# EAGLE design js220_bp (EAGLE 9.6.2)
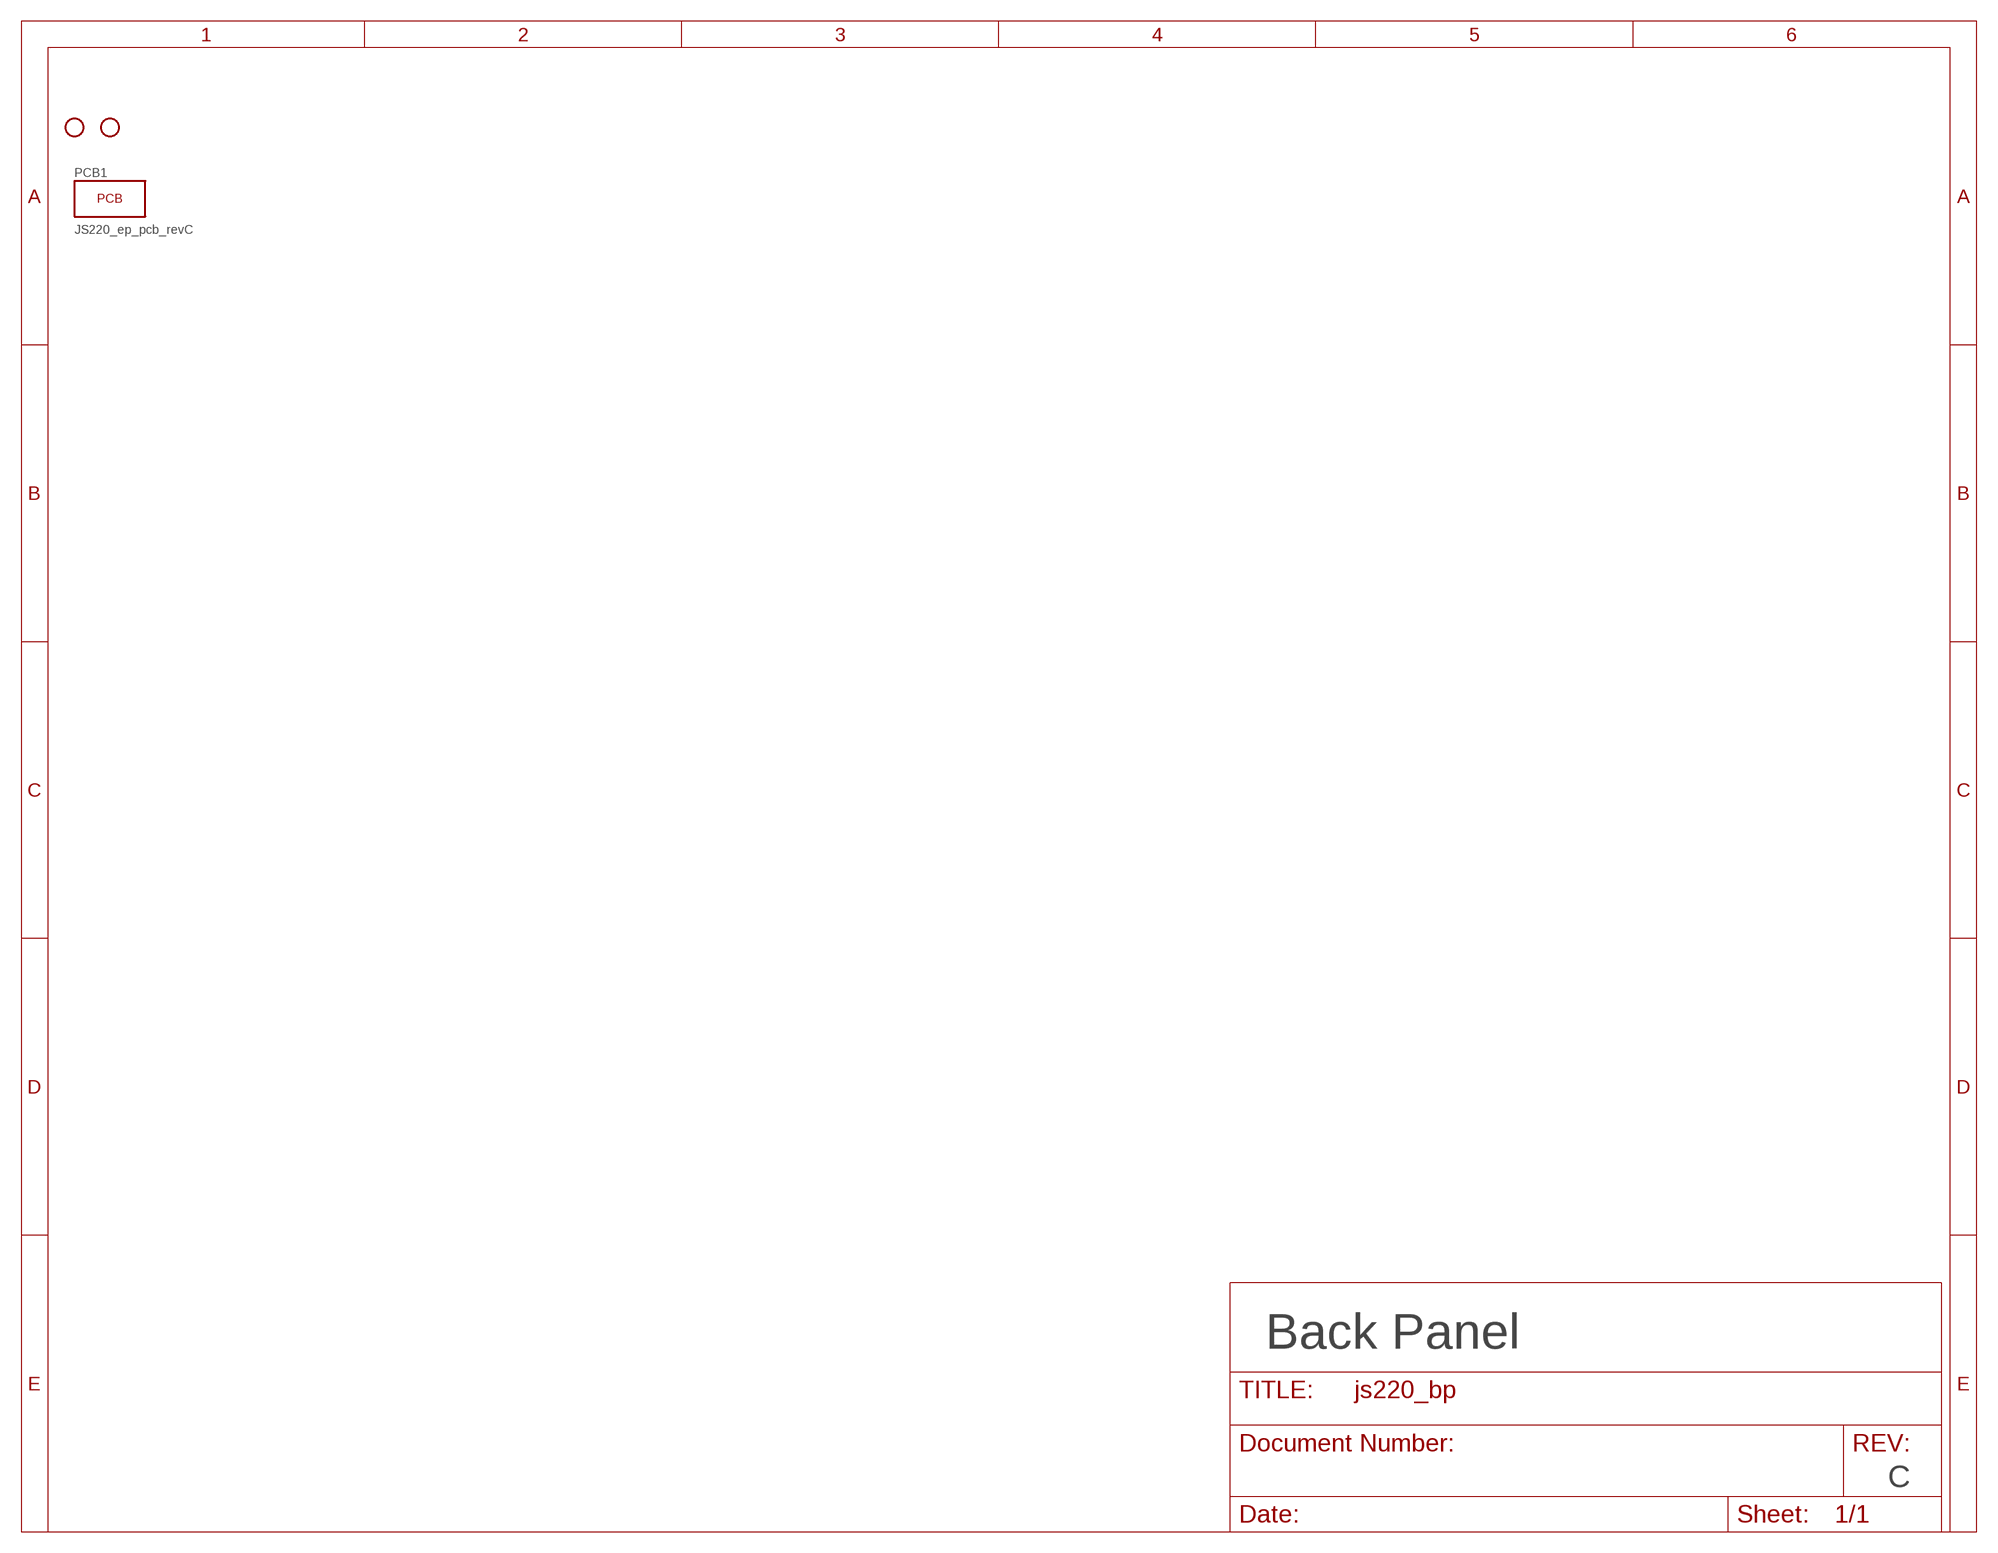
[diagram p0: schematic, sheet 1]
PCB1 (PCB): POPULATE: 1

## Parts
H1  HOLE_#6_NORESTRICT  [HOLE_3.5MM_NORESTRICT]
H2  HOLE_#6_NORESTRICT  [HOLE_3.5MM_NORESTRICT]

## Notes on the sheet
- Back Panel
- C

## Library data of the parts
H1 H2 = jetperch:HOLE; POPULATE: 0

## Board
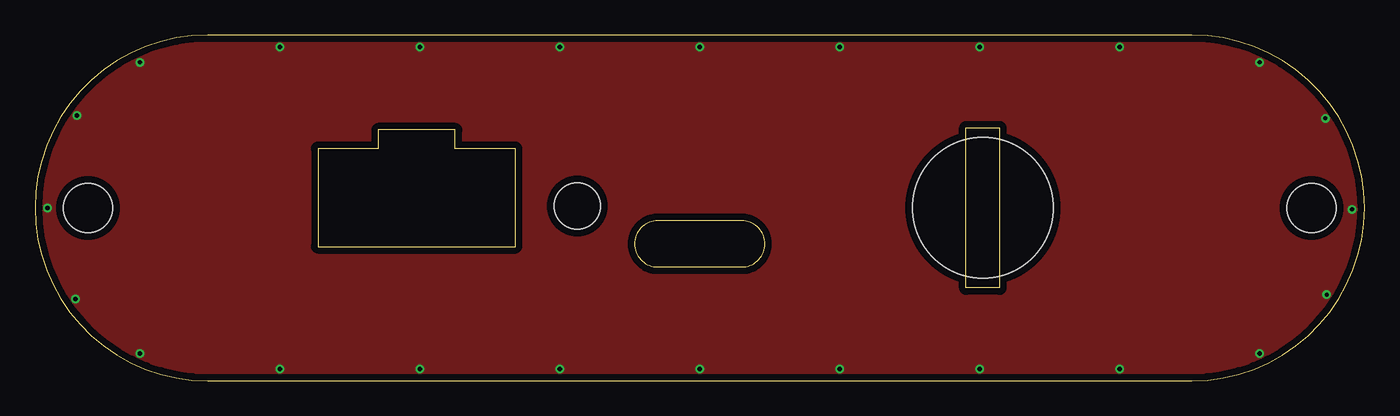
[diagram p1: board, top side]
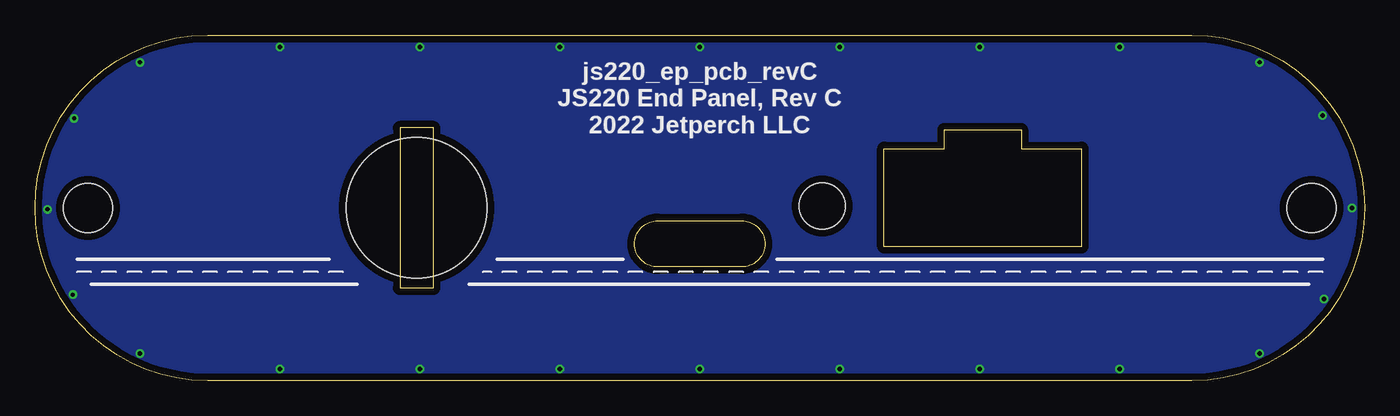
[diagram p2: board, bottom side, seen from below]

Size 95 x 24.7 mm. Coordinates in mm from the lower left corner, seen from the top.
Outline: 0,12.35 arc90 12.35,0 82.65,0 arc90 95,12.35 arc90 82.65,24.7 12.35,24.7 arc90 0,12.35
Outline: 42.85,9.79 arc90 44.51,8.13 50.49,8.13 arc90 52.15,9.79 arc90 50.49,11.44 44.51,11.44 arc90 42.85,9.79
Outline: 66.52,18.07 68.92,18.07 68.92,6.64 66.52,6.64 66.52,18.07
Outline: 20.23,9.58 34.33,9.58 34.33,16.58 30.03,16.58 30.03,17.93 24.53,17.93 24.53,16.58 20.23,16.58 20.23,9.58
Copper layers (1*16): Top 0.035mm / dielectric 62mil / Bottom 0.035mm
Design rules "jetperch_2layer *": minimum track width 6mil, minimum drill 12mil, track to track 10mil, track to pad 10mil, pad to pad 10mil, via to via 10mil, smd to smd 0mil, copper to edge 20mil, drill to drill 10mil, minimum pad ring 6mil, minimum via ring 6mil, stop-mask expansion 0mil, vias tented up to drill 15mil, thermal gap 10mil
Holes 3.3 mm at 38.75,12.5
Holes 10.05 mm at 67.72,12.36

### Footprints (pad centres in the part's own frame; a part is rotated, then mirrored left to right if it is on the bottom)
HOLE_3.5MM_NORESTRICT = hole 3.5: 0,0

### Placement (x,y rotation side)
H1  3.79,12.35 0 top
H2  91.21,12.35 0 top

### Tracks (layer width: path | path; a pad name or v marks a point on that pad's centre or on a via)
CGND  (via drill 0.3)
  other vias: 47.5,23.85 57.5,23.85 67.5,23.85 77.5,23.85 37.5,23.85 27.5,23.85 17.5,23.85 17.5,0.85 27.5,0.85 37.5,0.85 47.5,0.85 57.5,0.85 67.5,0.85 77.5,0.85 87.5,22.75 87.5,1.95 94.1,12.25 92.2,18.75 92.3,6.15 7.5,1.95 7.5,22.75 3,18.95 0.9,12.35 2.9,5.85
  pour Top (isolate 0.254): 12.35,24.7 82.65,24.7 arc-90 95,12.35 arc-90 82.65,0 12.35,0 arc-90 0,12.35 arc-90
  pour Bottom (isolate 0.254): 12.35,24.7 82.65,24.7 arc-90 95,12.35 arc-90 82.65,0 12.35,0 arc-90 0,12.35 arc-90

### Text on the board
bNames: js220_ep_pcb_revC / JS220 End Panel, Rev C / 2022 Jetperch LLC
tStop: Trigger | OUT0 / GND / IN2 / IN0 / Vref | Controller / Status | USB | OUT1 / GND / IN3 / IN1 / GND | GPIO | GPIO and trigger are / referenced to USB ground | Out: 3.3V, 50 Ω / In: TTL & 3.3V compatible
FabDoc1: All dimensions in millimeters | Place all markings on back (including pcb order number). / Add flammability rating marking on back, such as 94V-0. / The front-side surface is cosmetic - reject units with scratches and blemishes.